# Altium schematic sheet MAIN_GPS.SchDoc
size A3; DocumentNumber: 1; SheetNumber: 1; SheetTotal: 3
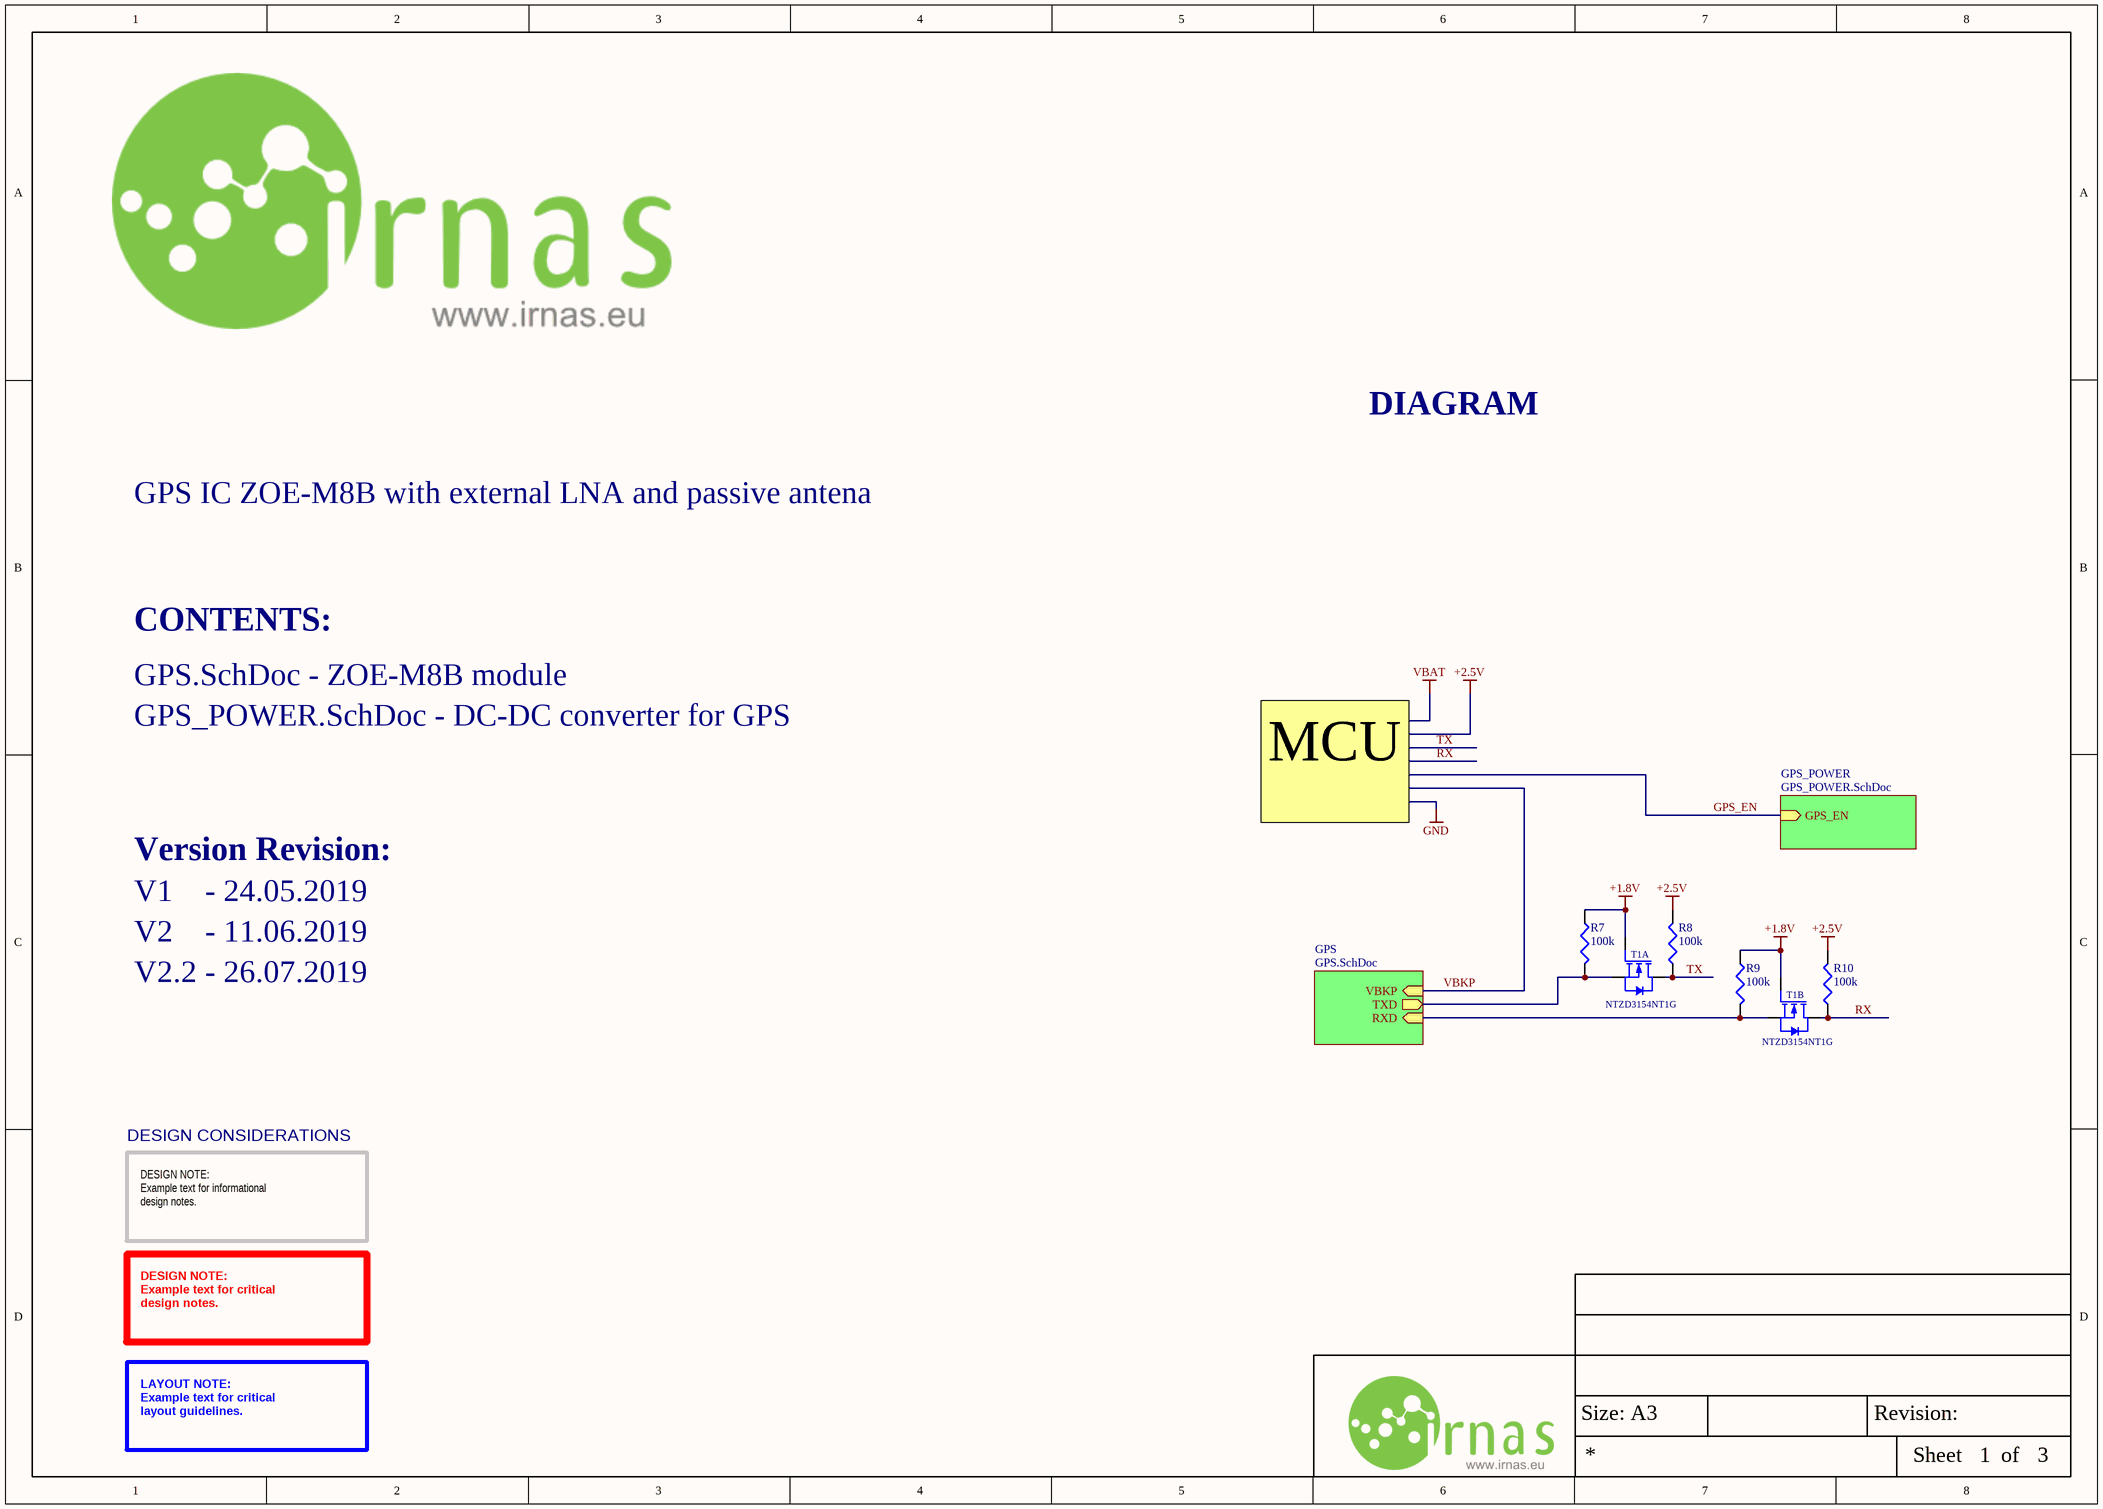
[diagram p0: MAIN_GPS.SchDoc]

## Parts
R7  100k  [RES0402]
R8  100k  [RES0402]
R9  100k  [RES0402]
R10  100k  [RES0402]
T1  NTZD3154NT1G  [SOT-563]  (parts A,B of 2)

## Sub-sheets
GPS = GPS.SchDoc: RXD (in), TXD (out), VBKP (in)
GPS_POWER = GPS_POWER.SchDoc: GPS_EN (in)

## Nets
+1.8V: R7.1 R9.1 T1.2(G1) T1.5(G2)
+2.5V: R8.2 R10.2
GPS_EN: sheet GPS_POWER/GPS_EN
RX: R10.1 T1.3(D2)
TX: R8.1 T1.6(D1)
VBKP: sheet GPS/VBKP
NetR7_2: R7.2 T1.1(S1) ; sheet GPS/TXD
NetR9_2: R9.2 T1.4(S2) ; sheet GPS/RXD

## Notes on the sheet
- DIAGRAM
- GPS IC ZOE-M8B with external LNA and passive antena
- CONTENTS:
- GPS.SchDoc - ZOE-M8B module
- GPS_POWER.SchDoc - DC-DC converter for GPS
- MCU
- Version Revision:
- V1    - 24.05.2019
- V2    - 11.06.2019
- V2.2 - 26.07.2019
- DESIGN CONSIDERATIONS
- DESIGN NOTE:
  Example text for informational
  design notes.
- DESIGN NOTE:
  Example text for critical
  design notes.
- LAYOUT NOTE:
  Example text for critical
  layout guidelines.
- Size: A3
- Revision:
- Sheet
- of

## Library data of the parts
R7-R10 = R - 100k/0402: MULTICOMP   MCWR04X1003FTL   RES, THICK FILM, 100KOHM, 1%, 0.0625W; IRNAS Part No.: I-100013; Resistance: 100kR; Power Rating: 62.5mW; Voltage Rating: 50V; Temperature Coefficient: 100ppm/°C; Supplier 1: Farnell; Manufacturer: Multicomp; Manufacturer Part Number: MCWR04X1003FTL; Stock 1: 161188; Pricing 1: 10=0.0029, 100=0.0017, 500=0.0012, 2500=0.001, 5000=0.0008 (EUR); Mount: Surface Mount; Case/Package: 0402; Case Code (Metric): 1005; Case Code (Imperial): 0402; Tolerance: 1%; Packaging: Cut Tape; Composition: Thick Film; Voltage Rating (DC): 50V; REACH SVHC: No SVHC; ComponentLink1URL: https://datasheet.ciiva.com/46386/1849611-46386524.pdf; ComponentLink1Description: https://datasheet.ciiva.com/46386/1849611-46386524.pdf; Supplier Part Number 1: 2447094
T1 = T_M - NTZD3154NT1G: Dual MOSFET, Dual N Channel, 540 mA, 20 V, 0.4 ohm, 4.5 V, 1 V; ELRAD Id sifra / ELRAD Id No: 597778; Opis / Description: MOSFET BSS123       /N-Channel; Komp / Device: SMD; Value: BSS123; Velikost / Size: SOT23; FIT: 0.44; Author: Ciril Golob; Date: 11.07.2018; ComponentLINK1Description: Datasheet; ComponentLINK2Description: Datasheet www; ComponentLINK1URL: c:\ELRADSVN\Altium_Library\Libraries\Active\Datasheet\BSS123.pdf; ComponentLINK2URL: http://www.onsemi.com/pub/Collateral/BSS123-D.PDF; Supplier 1: Farnell; Supplier Part Number 1: 2533209